# Altium schematic sheet CONNECTOR.SchDoc
size 420 x 297 mm; SheetNumber: 4; SheetTotal: 21
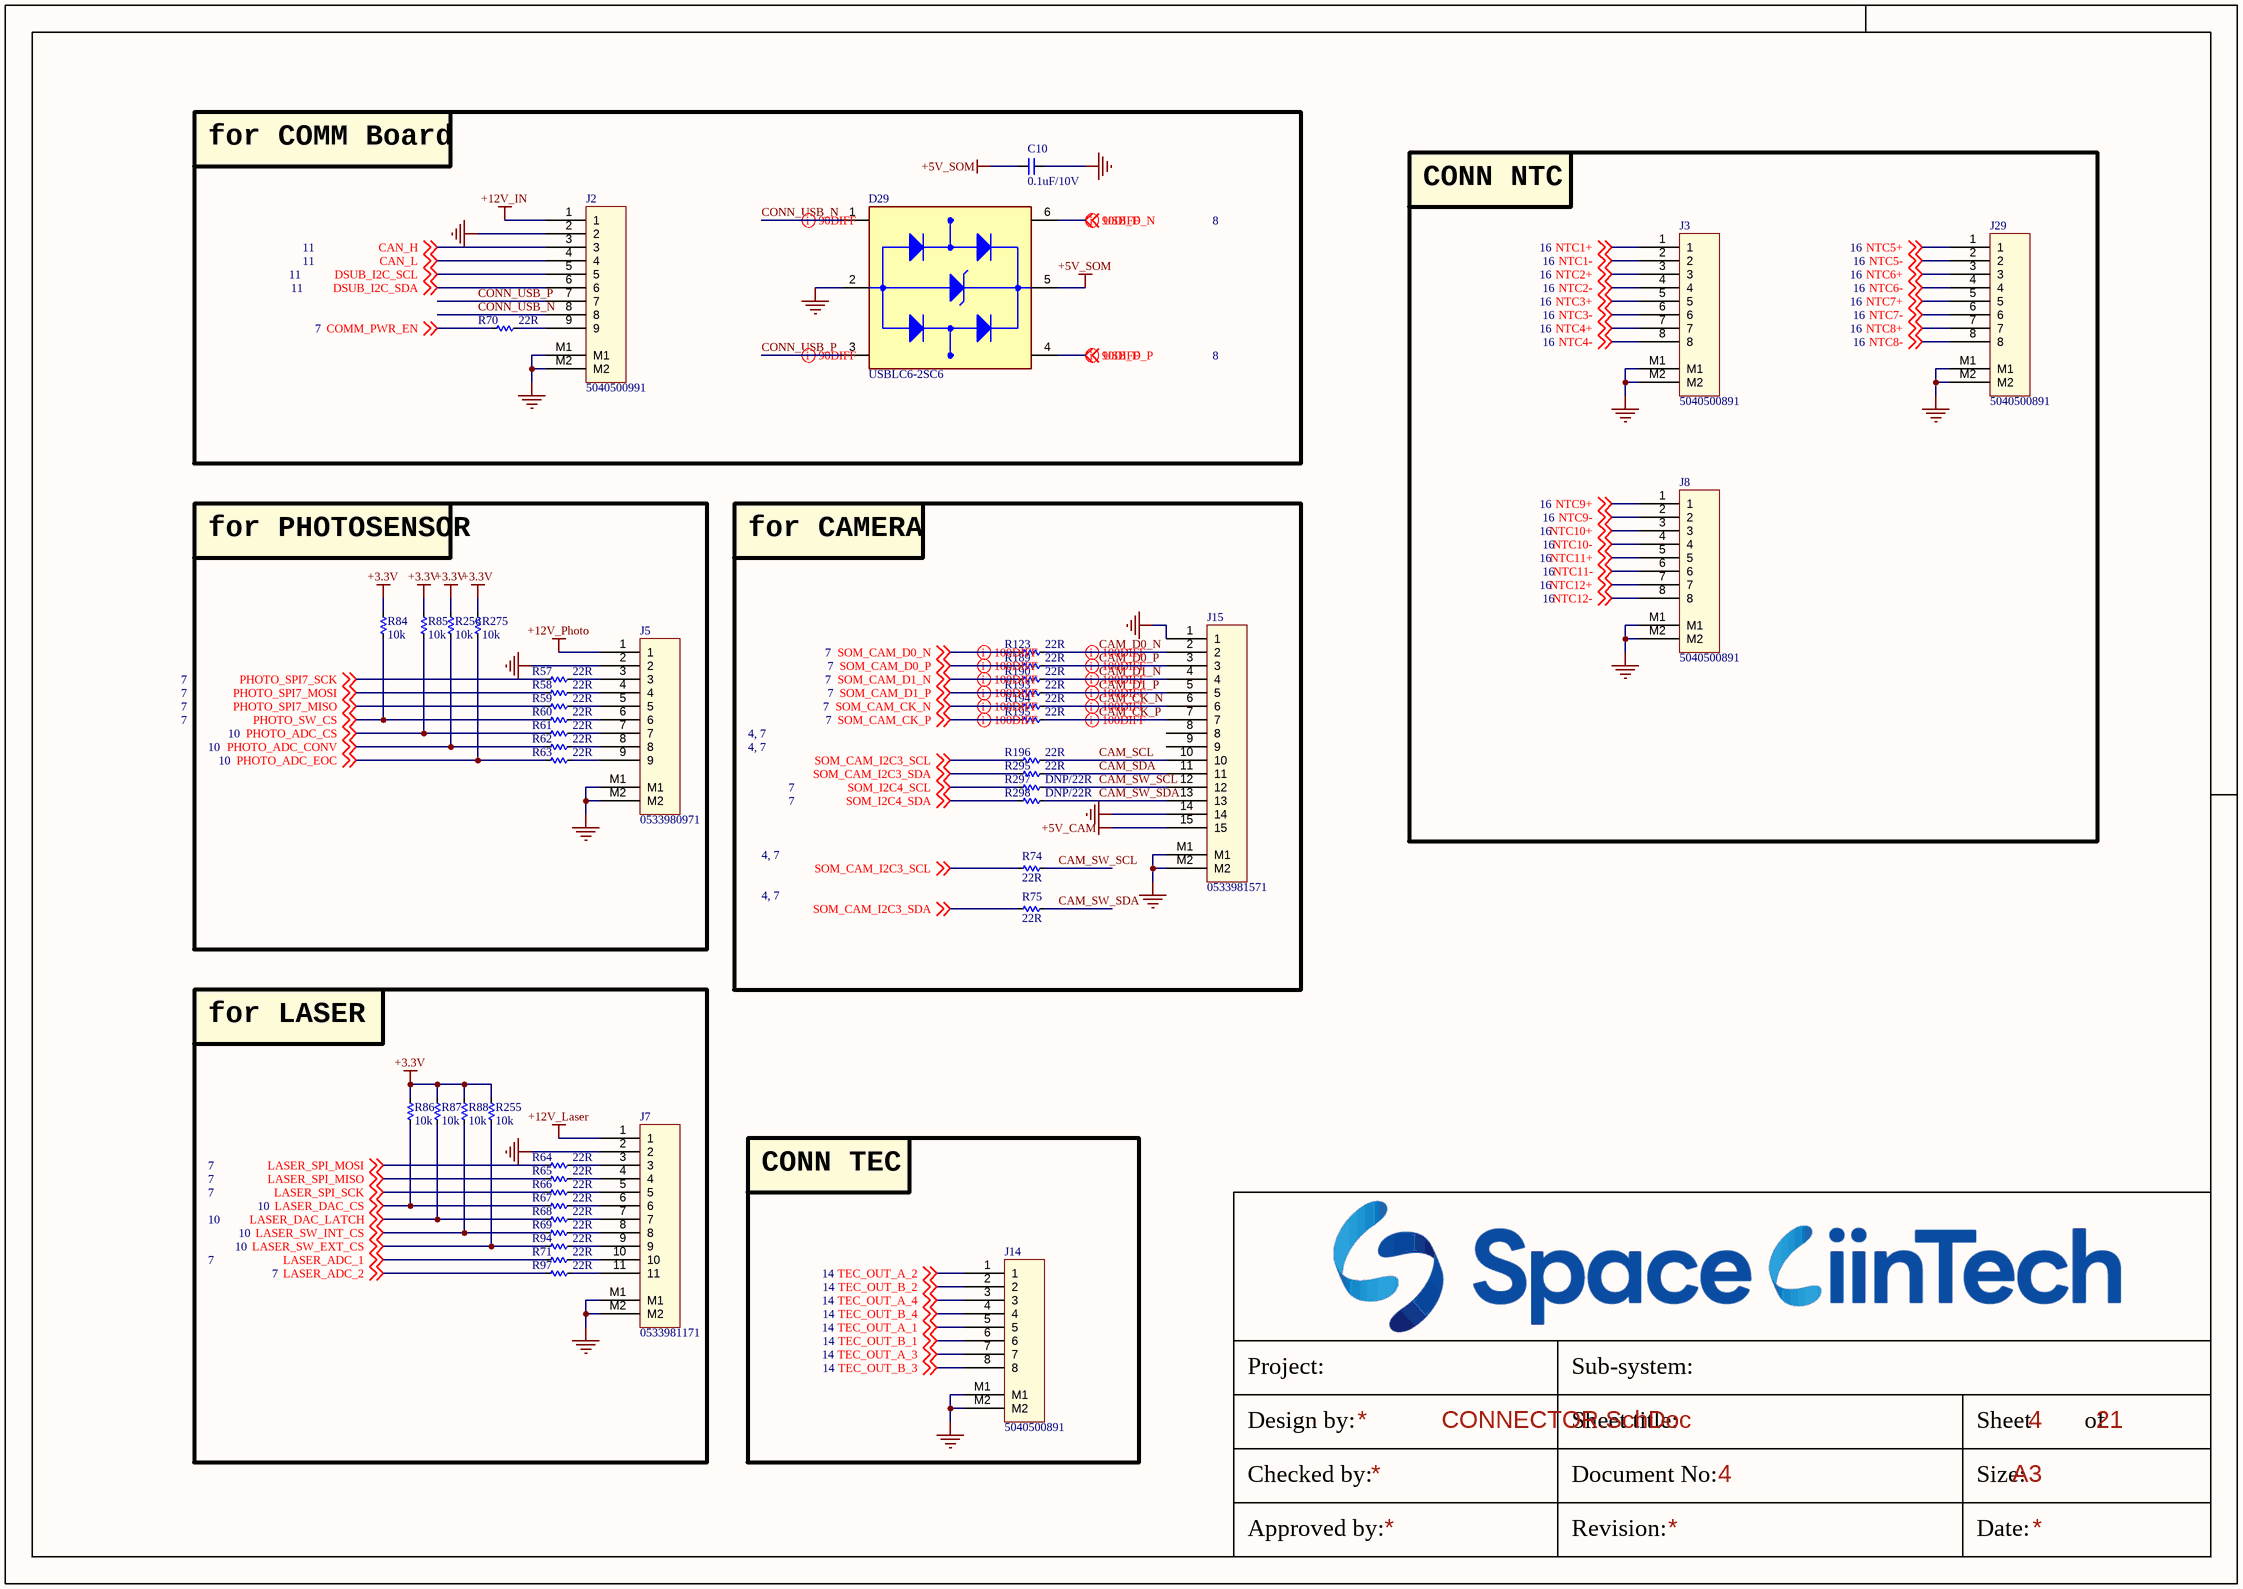
[diagram p0: CONNECTOR.SchDoc]

## Parts
C10  0.1uF/10V  [CAP_C_1005X60]
D29  USBLC6-2SC6  [SOT95P280X145-6N]
J2  5040500991  [Molex_5040500991]
J3  5040500891  [MOLEX_5040500891]
J5  0533980971  [MOLEX_0533980971]
J7  0533981171  [MOLEX_0533981171]
J8  5040500891  [MOLEX_5040500891]
J14  5040500891  [MOLEX_5040500891]
J15  0533981571  [MOLEX_0533981571]
J29  5040500891  [MOLEX_5040500891]
R57  22R  [RES_C_1005X40]
R58  22R  [RES_C_1005X40]
R59  22R  [RES_C_1005X40]
R60  22R  [RES_C_1005X40]
R61  22R  [RES_C_1005X40]
R62  22R  [RES_C_1005X40]
R63  22R  [RES_C_1005X40]
R64  22R  [RES_C_1005X40]
R65  22R  [RES_C_1005X40]
R66  22R  [RES_C_1005X40]
R67  22R  [RES_C_1005X40]
R68  22R  [RES_C_1005X40]
R69  22R  [RES_C_1005X40]
R70  22R  [RES_C_1005X40]
R71  22R  [RES_C_1005X40]
R74  22R  [RES_C_1005X40]
R75  22R  [RES_C_1005X40]
R84  10k  [RES_C_1005X40]
R85  10k  [RES_C_1005X40]
R86  10k  [RES_C_1005X40]
R87  10k  [RES_C_1005X40]
R88  10k  [RES_C_1005X40]
R94  22R  [RES_C_1005X40]
R97  22R  [RES_C_1005X40]
R123  22R  [RES_C_1005X40]
R189  22R  [RES_C_1005X40]
R190  22R  [RES_C_1005X40]
R193  22R  [RES_C_1005X40]
R194  22R  [RES_C_1005X40]
R195  22R  [RES_C_1005X40]
R196  22R  [RES_C_1005X40]
R255  10k  [RES_C_1005X40]
R256  10k  [RES_C_1005X40]
R275  10k  [RES_C_1005X40]
R295  22R  [RES_C_1005X40]
R297  DNP/22R  [RES_C_1005X40]
R298  DNP/22R  [RES_C_1005X40]

## Blocks framed on the sheet
for COMM Board: C10 D29 J2 R70
CONN NTC: J3 J8 J29
for PHOTOSENSOR: J5 R57-R63 R84 R85 R256 R275
for CAMERA: J15 R74 R75 R123 R189 R190 R193-R196 R295 R297 R298
for LASER: J7 R64-R69 R71 R86-R88 R94 R97 R255
CONN TEC: J14

## Nets
+3.3V: R84.1 R85.1 R86.1 R87.1 R88.1 R255.1 R256.1 R275.1
+5V_CAM: J15.15
+5V_SOM: C10.2 D29.5(VBUS)
+12V_IN: J2.1
+12V_Laser: J7.1
+12V_Photo: J5.1
GND: C10.1 D29.2(GND) J2.2 J2.M1 J2.M2 J3.M1 J3.M2 J5.2 J5.M1 J5.M2 J7.2 J7.M1 J7.M2 J8.M1 J8.M2 J14.M1 J14.M2 J15.1 J15.14 J15.M1 J15.M2 J29.M1 J29.M2
CAM_CK_N: J15.6 R194.2
CAM_CK_P: J15.7 R195.2
CAM_D0_N: J15.2 R123.2
CAM_D0_P: J15.3 R189.2
CAM_D1_N: J15.4 R190.2
CAM_D1_P: J15.5 R193.2
CAM_SCL: J15.10 R196.2
CAM_SDA: J15.11 R295.2
CAM_SW_SCL: J15.12 R74.1 R297.2
CAM_SW_SDA: J15.13 R75.1 R298.2
CAN_H: J2.3 ; off-sheet CAN_H
CAN_L: J2.4 ; off-sheet CAN_L
COMM_PWR_EN: R70.1 ; off-sheet COMM_PWR_EN
CONN_USB_N: D29.1(I/O1_IN) J2.8
CONN_USB_P: D29.3(I/O2_IN) J2.7
DSUB_I2C_SCL: J2.5 ; off-sheet DSUB_I2C_SCL
DSUB_I2C_SDA: J2.6 ; off-sheet DSUB_I2C_SDA
LASER_ADC_1: R71.1 ; off-sheet LASER_ADC_1
LASER_ADC_2: R97.1 ; off-sheet LASER_ADC_2
LASER_DAC_CS: R67.1 R86.2 ; off-sheet LASER_DAC_CS
LASER_DAC_LATCH: R68.1 R87.2 ; off-sheet LASER_DAC_LATCH
LASER_SPI_MISO: R65.1 ; off-sheet LASER_SPI_MISO
LASER_SPI_MOSI: R64.1 ; off-sheet LASER_SPI_MOSI
LASER_SPI_SCK: R66.1 ; off-sheet LASER_SPI_SCK
LASER_SW_EXT_CS: R94.1 R255.2 ; off-sheet LASER_SW_EXT_CS
LASER_SW_INT_CS: R69.1 R88.2 ; off-sheet LASER_SW_INT_CS
NTC1+: J3.1 ; off-sheet NTC1+
NTC1-: J3.2 ; off-sheet NTC1-
NTC2+: J3.3 ; off-sheet NTC2+
NTC2-: J3.4 ; off-sheet NTC2-
NTC3+: J3.5 ; off-sheet NTC3+
NTC3-: J3.6 ; off-sheet NTC3-
NTC4+: J3.7 ; off-sheet NTC4+
NTC4-: J3.8 ; off-sheet NTC4-
NTC5+: J29.1 ; off-sheet NTC5+
NTC5-: J29.2 ; off-sheet NTC5-
NTC6+: J29.3 ; off-sheet NTC6+
NTC6-: J29.4 ; off-sheet NTC6-
NTC7+: J29.5 ; off-sheet NTC7+
NTC7-: J29.6 ; off-sheet NTC7-
NTC8+: J29.7 ; off-sheet NTC8+
NTC8-: J29.8 ; off-sheet NTC8-
NTC9+: J8.1 ; off-sheet NTC9+
NTC9-: J8.2 ; off-sheet NTC9-
NTC10+: J8.3 ; off-sheet NTC10+
NTC10-: J8.4 ; off-sheet NTC10-
NTC11+: J8.5 ; off-sheet NTC11+
NTC11-: J8.6 ; off-sheet NTC11-
NTC12+: J8.7 ; off-sheet NTC12+
NTC12-: J8.8 ; off-sheet NTC12-
PHOTO_ADC_CONV: R62.1 R256.2 ; off-sheet PHOTO_ADC_CONV
PHOTO_ADC_CS: R61.1 R85.2 ; off-sheet PHOTO_ADC_CS
PHOTO_ADC_EOC: R63.1 R275.2 ; off-sheet PHOTO_ADC_EOC
PHOTO_SPI7_MISO: R59.1 ; off-sheet PHOTO_SPI7_MISO
PHOTO_SPI7_MOSI: R58.1 ; off-sheet PHOTO_SPI7_MOSI
PHOTO_SPI7_SCK: R57.1 ; off-sheet PHOTO_SPI7_SCK
PHOTO_SW_CS: R60.1 R84.2 ; off-sheet PHOTO_SW_CS
SOM_CAM_CK_N: R194.1 ; off-sheet SOM_CAM_CK_N
SOM_CAM_CK_P: R195.1 ; off-sheet SOM_CAM_CK_P
SOM_CAM_D0_N: R123.1 ; off-sheet SOM_CAM_D0_N
SOM_CAM_D0_P: R189.1 ; off-sheet SOM_CAM_D0_P
SOM_CAM_D1_N: R190.1 ; off-sheet SOM_CAM_D1_N
SOM_CAM_D1_P: R193.1 ; off-sheet SOM_CAM_D1_P
SOM_CAM_I2C3_SCL: R74.2 R196.1 ; off-sheet SOM_CAM_I2C3_SCL
SOM_CAM_I2C3_SDA: R75.2 R295.1 ; off-sheet SOM_CAM_I2C3_SDA
SOM_I2C4_SCL: R297.1 ; off-sheet SOM_I2C4_SCL
SOM_I2C4_SDA: R298.1 ; off-sheet SOM_I2C4_SDA
TEC_OUT_A_1: J14.5 ; off-sheet TEC_OUT_A_1
TEC_OUT_A_2: J14.1 ; off-sheet TEC_OUT_A_2
TEC_OUT_A_3: J14.7 ; off-sheet TEC_OUT_A_3
TEC_OUT_A_4: J14.3 ; off-sheet TEC_OUT_A_4
TEC_OUT_B_1: J14.6 ; off-sheet TEC_OUT_B_1
TEC_OUT_B_2: J14.2 ; off-sheet TEC_OUT_B_2
TEC_OUT_B_3: J14.8 ; off-sheet TEC_OUT_B_3
TEC_OUT_B_4: J14.4 ; off-sheet TEC_OUT_B_4
USB_D_N: D29.6(I/O1_OUT) ; off-sheet USB_D_N
USB_D_P: D29.4(I/O2_OUT) ; off-sheet USB_D_P
NetJ2_9: J2.9 R70.2
NetJ5_3: J5.3 R57.2
NetJ5_4: J5.4 R58.2
NetJ5_5: J5.5 R59.2
NetJ5_6: J5.6 R60.2
NetJ5_7: J5.7 R61.2
NetJ5_8: J5.8 R62.2
NetJ5_9: J5.9 R63.2
NetJ7_3: J7.3 R64.2
NetJ7_4: J7.4 R65.2
NetJ7_5: J7.5 R66.2
NetJ7_6: J7.6 R67.2
NetJ7_7: J7.7 R68.2
NetJ7_8: J7.8 R69.2
NetJ7_9: J7.9 R94.2
NetJ7_10: J7.10 R71.2
NetJ7_11: J7.11 R97.2

Not connected (* = marked no-connect by the designer): J15 8 9

## Layout directives
differential pair; differential pair class DIFF90: CONN_USB_N, CONN_USB_P, USB_D_N, USB_D_P
differential pair; differential pair class DIFF100: CAM_CK_N, CAM_CK_P, CAM_D0_N, CAM_D0_P, CAM_D1_N, CAM_D1_P, SOM_CAM_CK_N, SOM_CAM_CK_P, SOM_CAM_D0_N, SOM_CAM_D0_P, SOM_CAM_D1_N, SOM_CAM_D1_P

## Notes on the sheet
- Project:
- Sub-system:
- Design by:
- Sheet title:
- Sheet
- of
- Checked by:
- Approved by:
- Revision:
- Document No:
- Size:
- Date:
- A3

## Library data of the parts
C10 = _CAP_C_2: CAP CHIP
D29 = USBLC6-2SC6: 17V Clamp 5A (8/20Âµs) Ipp Tvs Diode Surface Mount SOT-23-6; MF: STMicroelectronics; Value: *; SnapEDA_Link: https://www.snapeda.com/parts/USBLC6-2SC6/STMicroelectronics/view-part/?ref=snap; Check_prices: https://www.snapeda.com/parts/USBLC6-2SC6/STMicroelectronics/view-part/?ref=eda; Purchase-URL: https://pricing.snapeda.com/search/part/USBLC6-2SC6/?ref=eda; Price: None; Availability: In Stock; Package: SOT-23-6 STMicroelectronics; MP: USBLC6-2SC6
J2 J5 = Header 9x1_2M
J3 J8 J14 J29 = Header 8x1_2M
J7 = Header 11x1_2M
J15 = Header 15x1_2M
R57-R71 R74 R75 R84-R88 R94 R97 R123 R189 R190 R193-R196 R255 R256 R275 R295 R297 R298 = _RES_B_2: RES